# EAGLE schematic DP_current_measure_v2 (EAGLE 9.4.2)
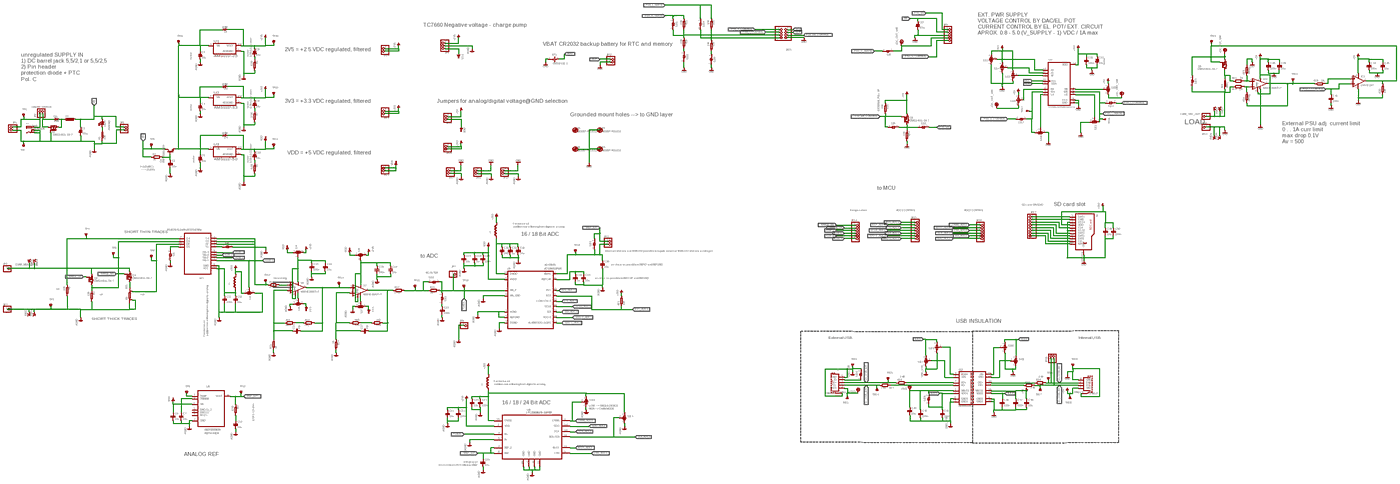
[diagram p0: schematic, sheet 1, overview]
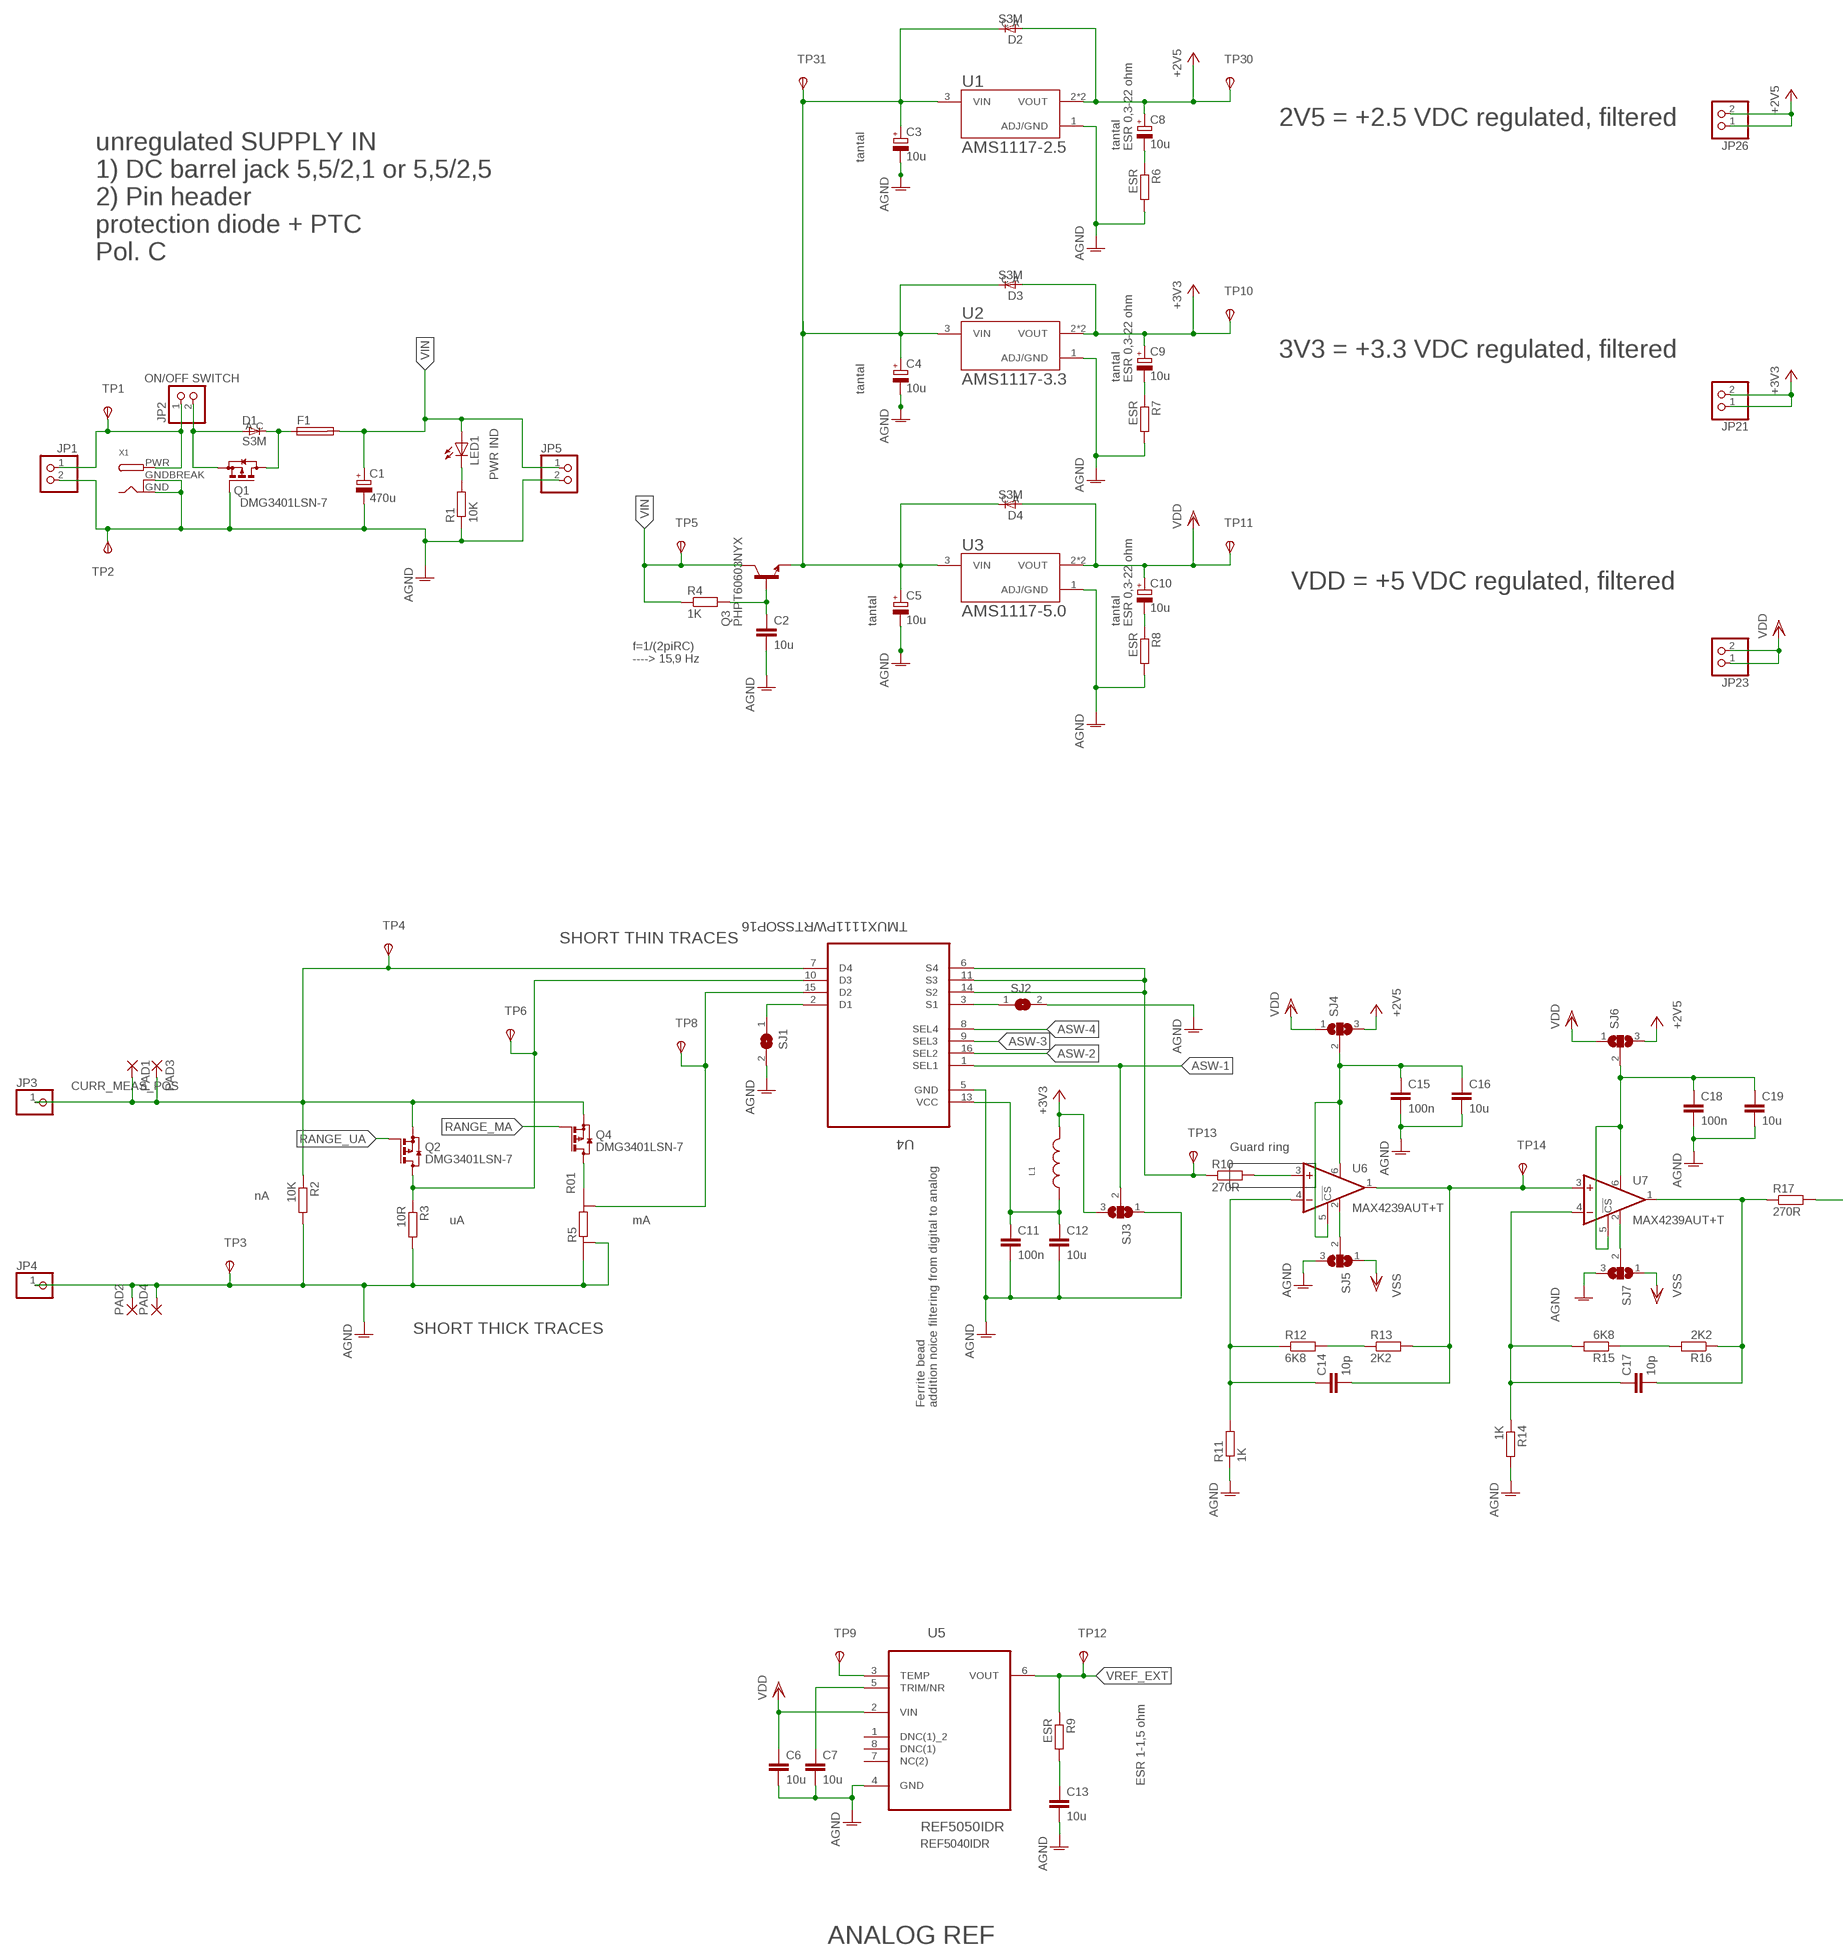
[diagram p1: schematic, sheet 1, part 1 of 4]
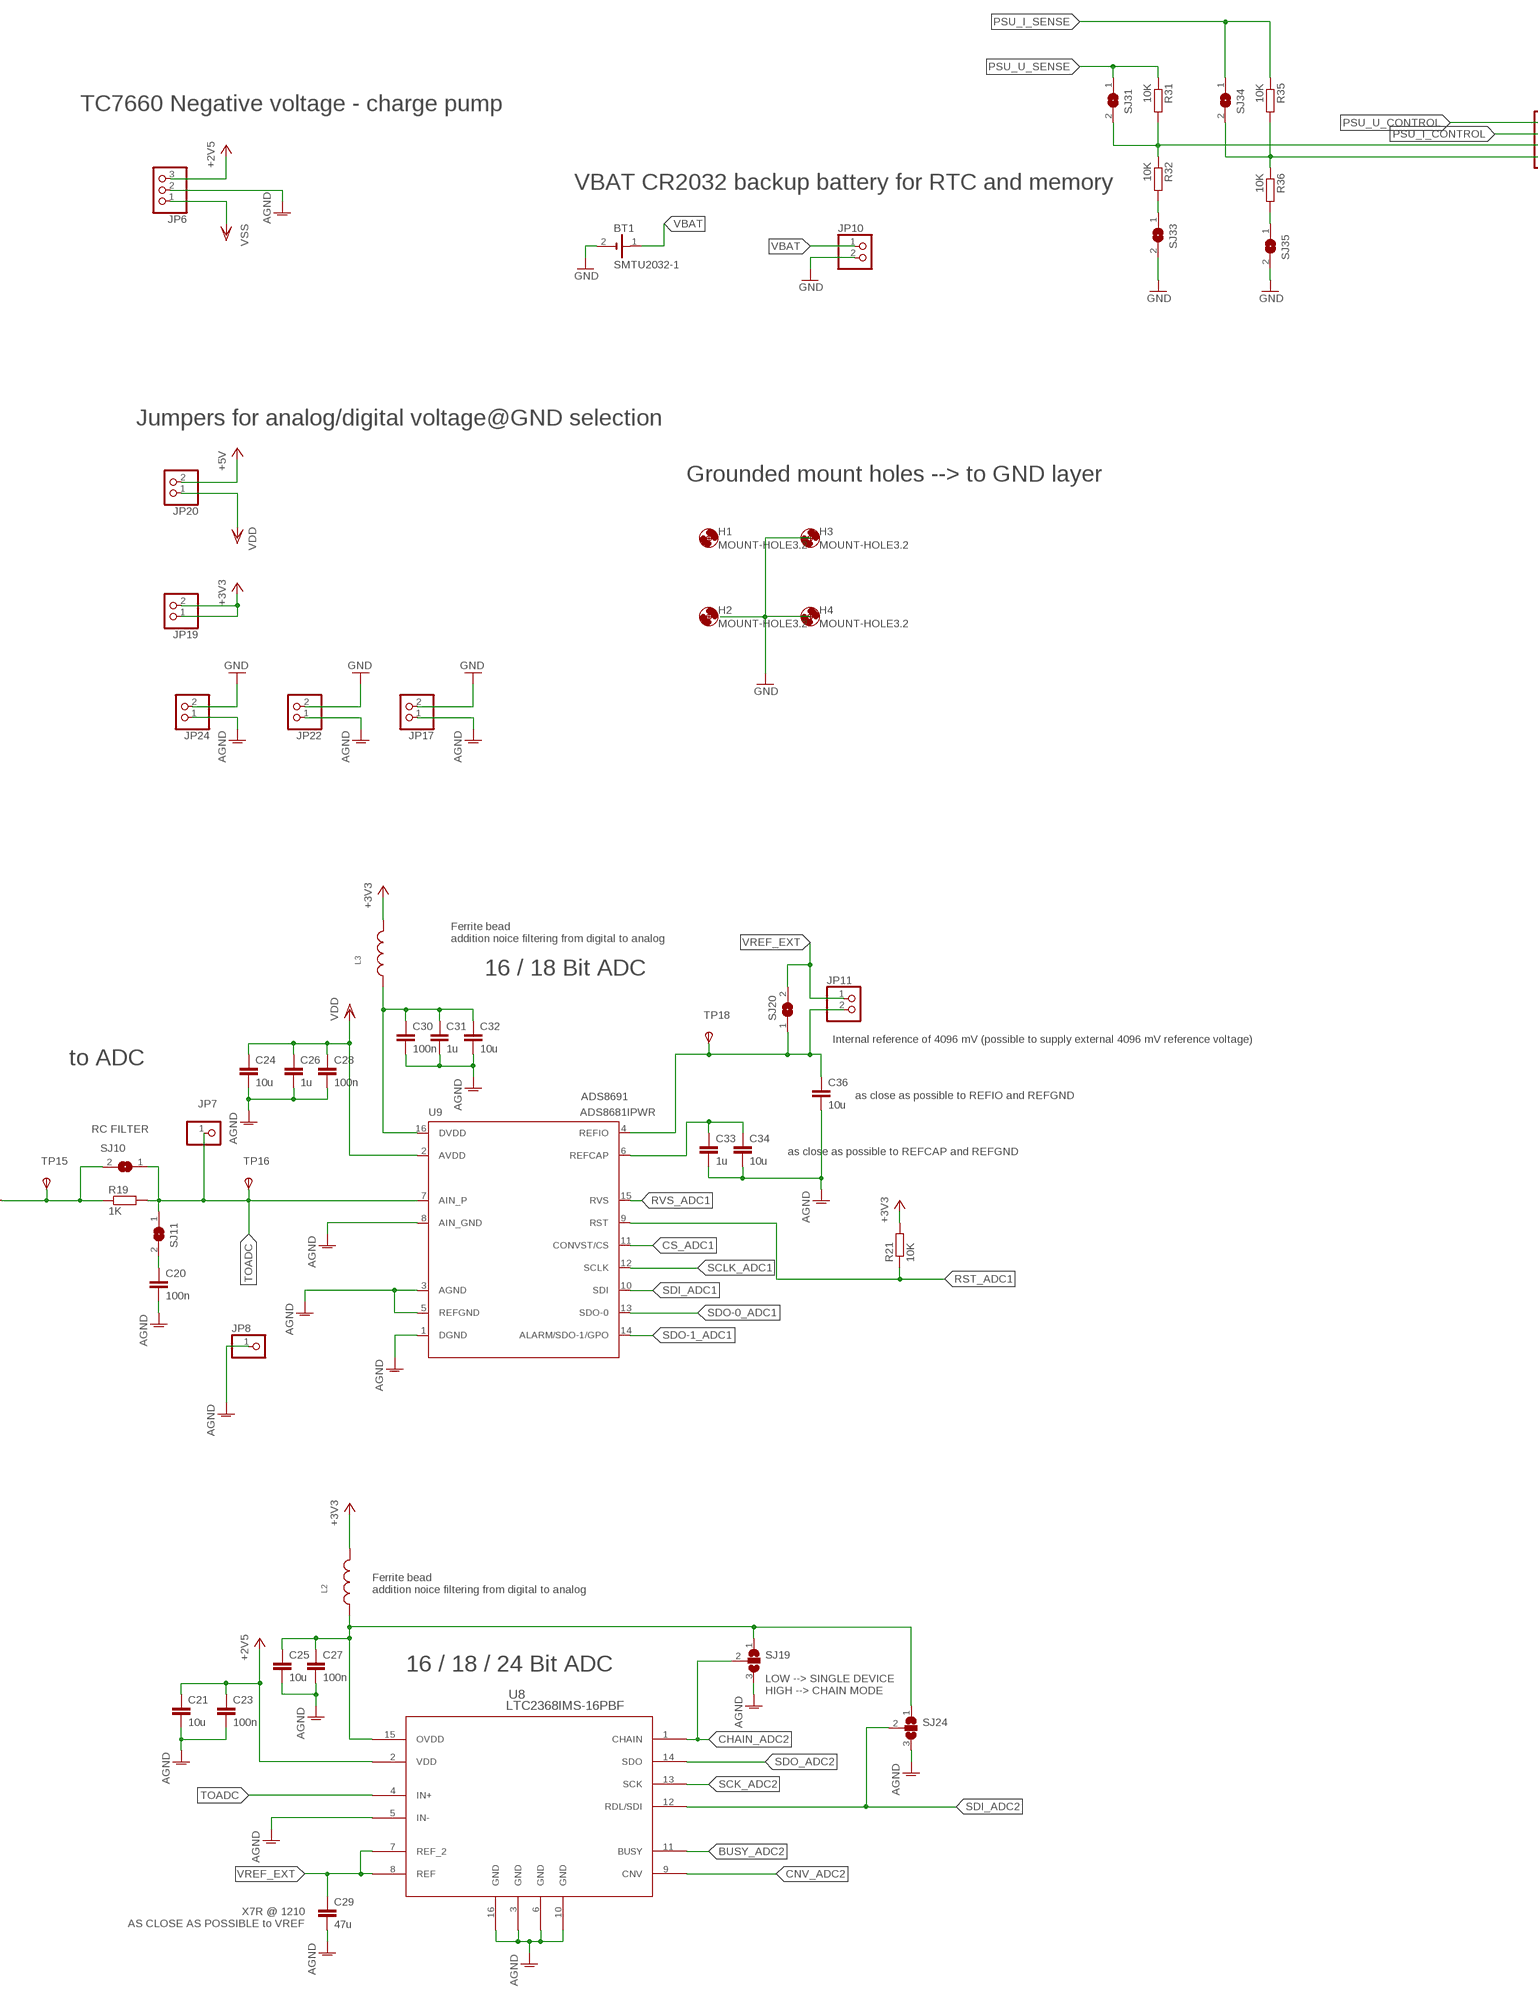
[diagram p2: schematic, sheet 1, part 2 of 4]
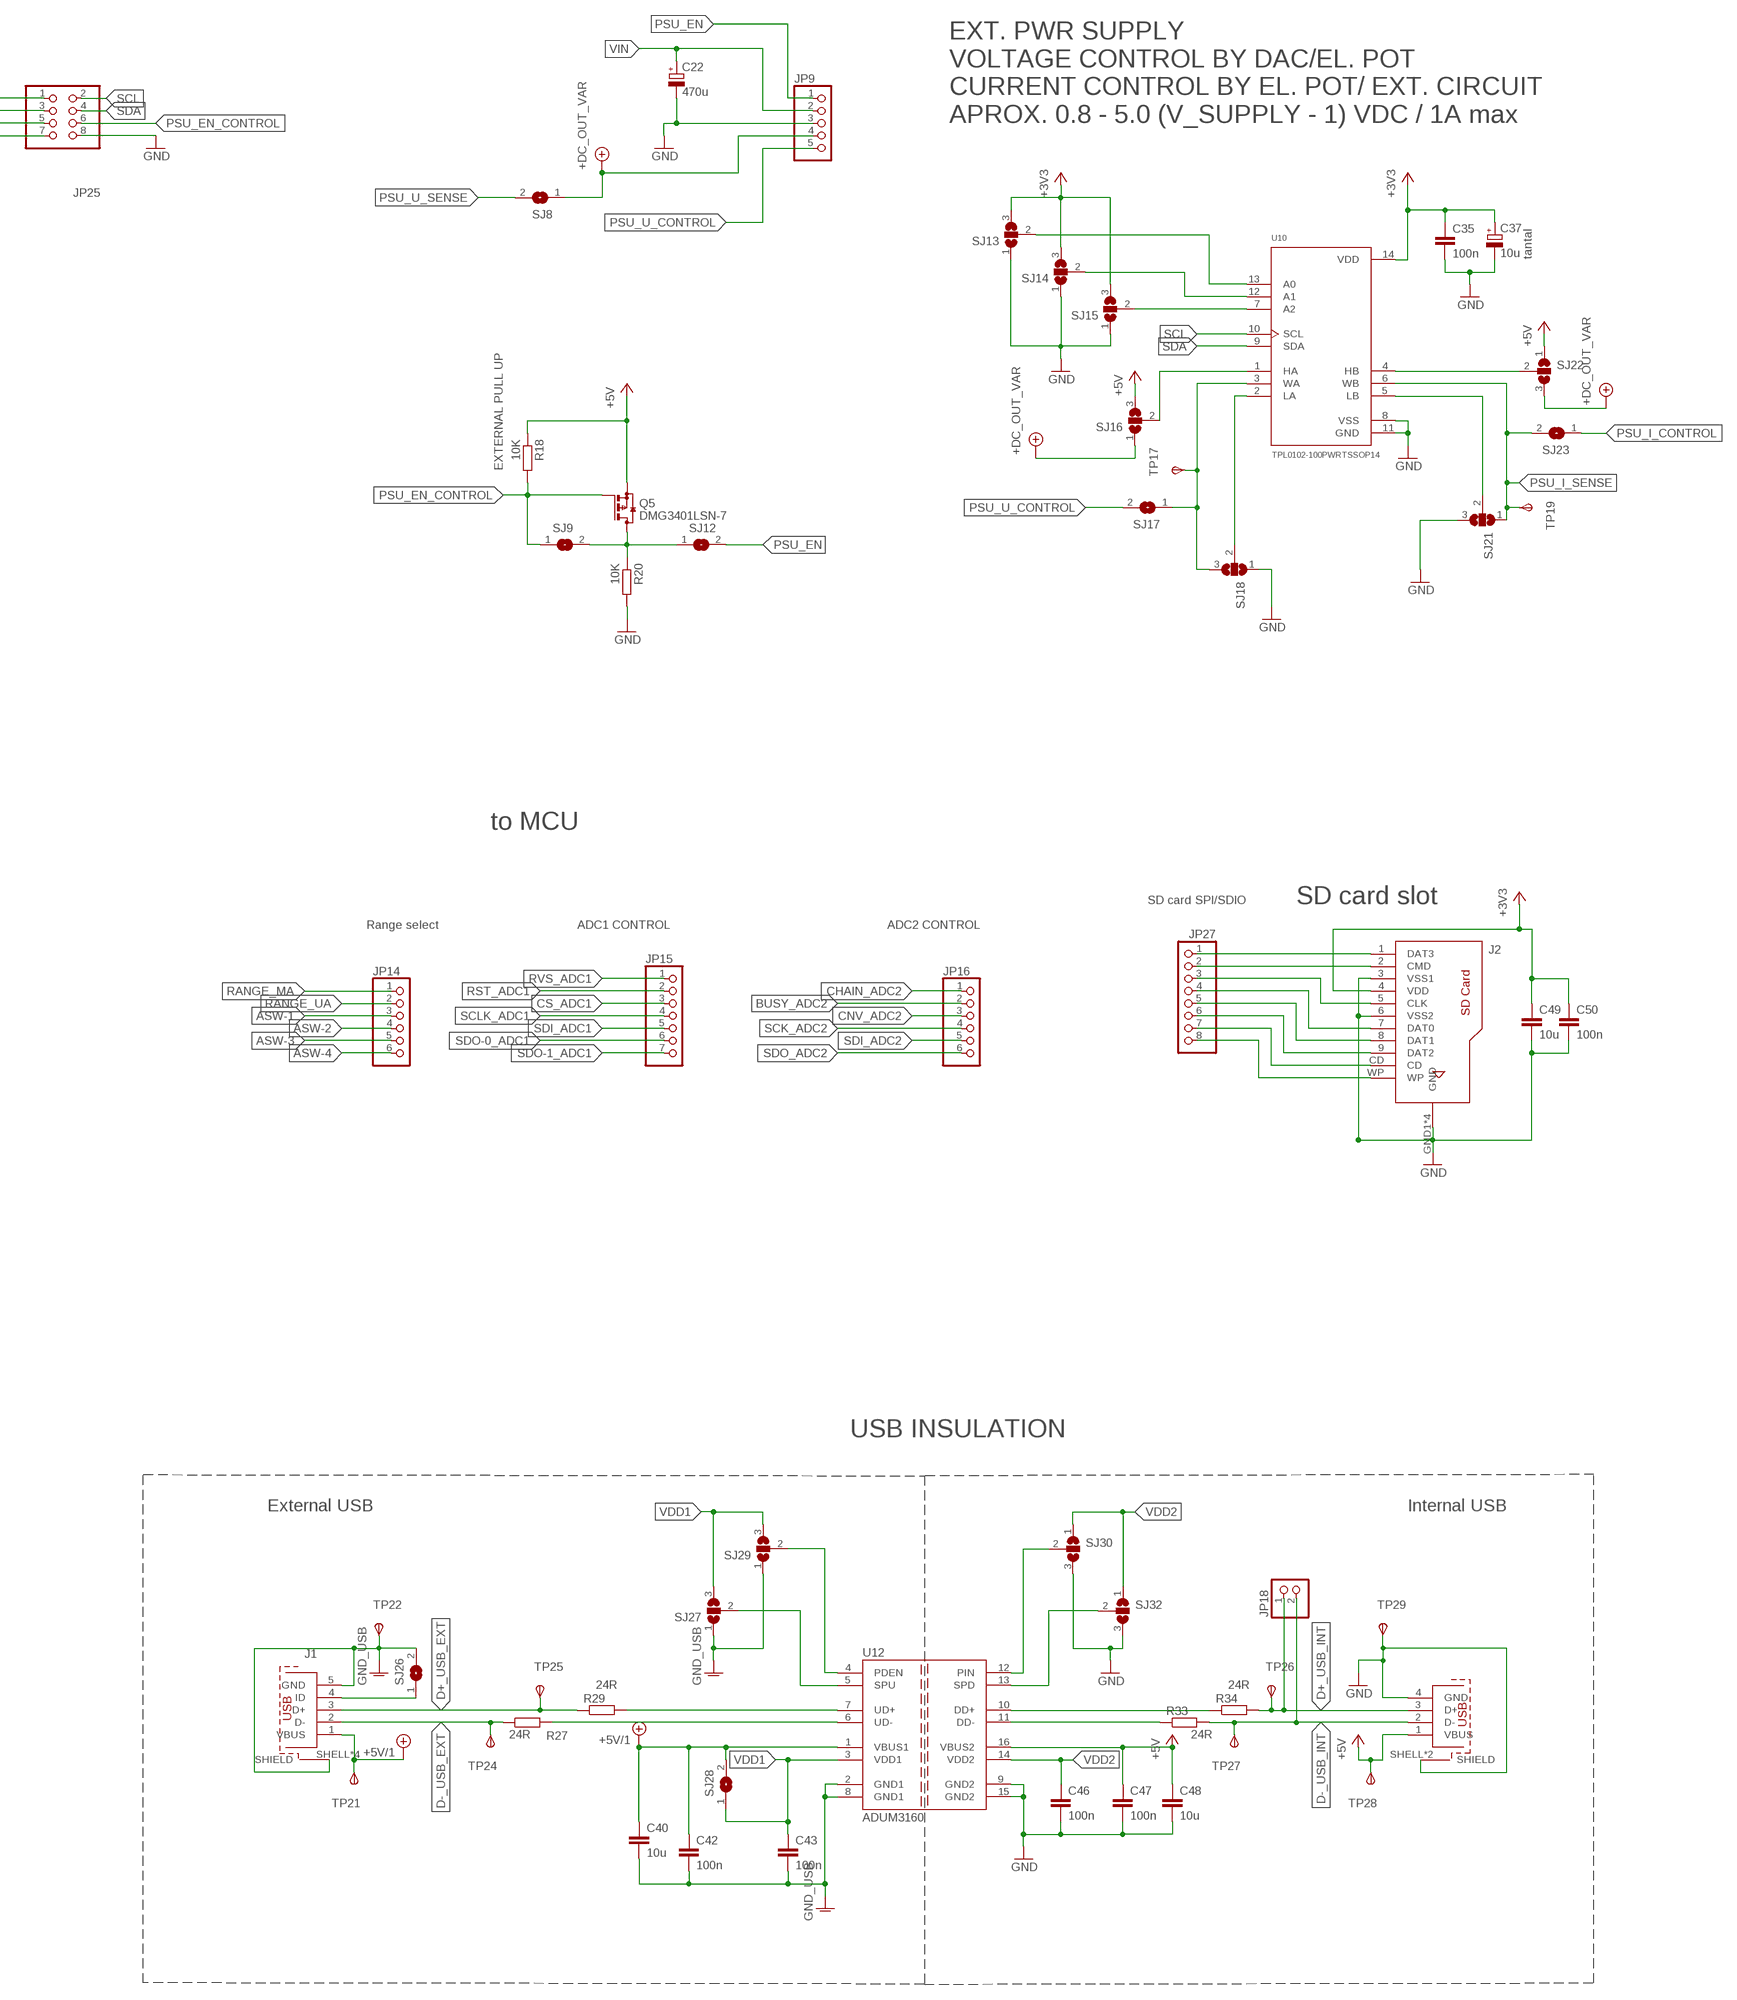
[diagram p3: schematic, sheet 1, part 3 of 4]
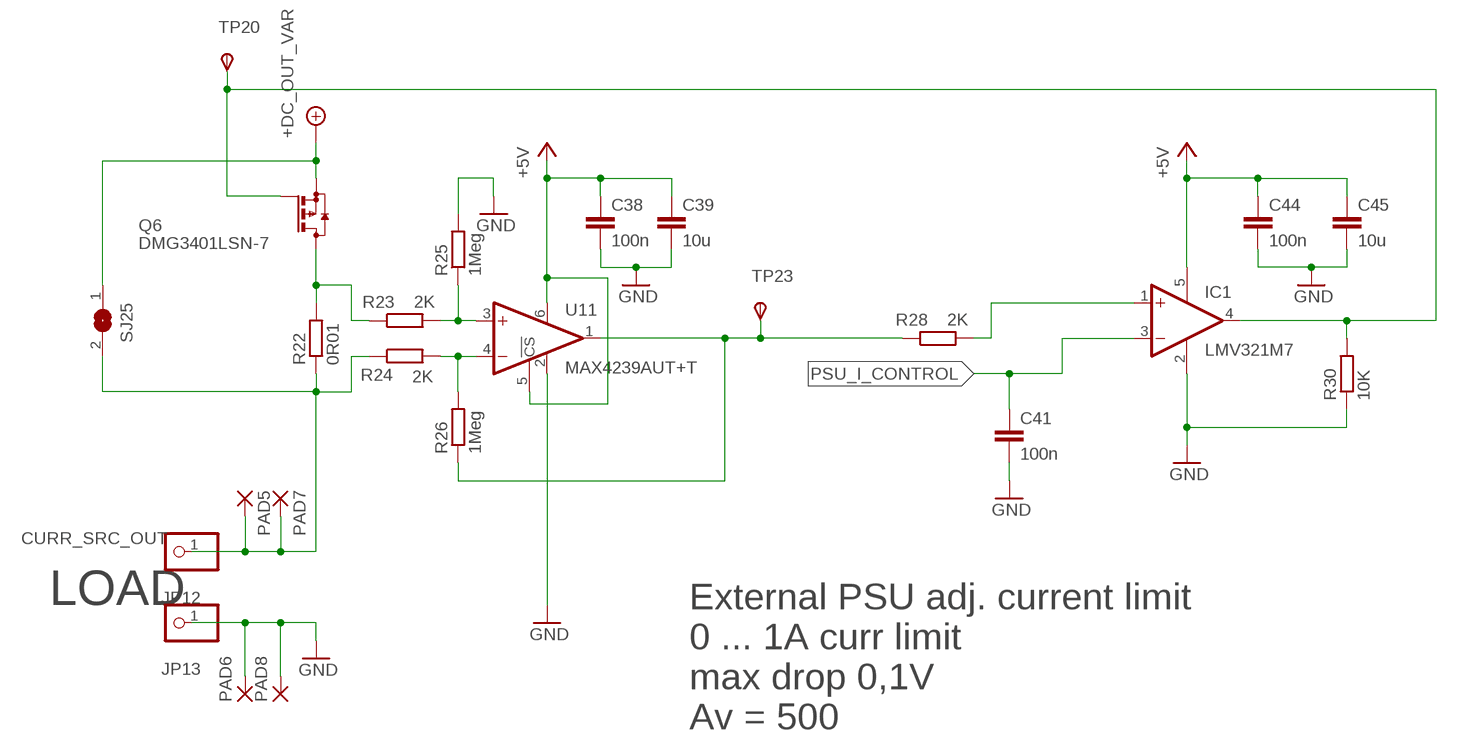
[diagram p4: schematic, sheet 1, part 4 of 4]

## Parts
BT1  SMTU2032-1  [RENATA_SMTU2032-1]
C1  470u  CPOL-EUG  [PANASONIC_G]
C2  10u  C-EUC1206  [C1206]
C3  10u  CPOL-EUSMCB  [SMC_B]
C4  10u  CPOL-EUSMCB  [SMC_B]
C5  10u  CPOL-EUSMCB  [SMC_B]
C6  10u  C-EUC1206  [C1206]
C7  10u  C-EUC1206  [C1206]
C8  10u  CPOL-EUSMCB  [SMC_B]
C9  10u  CPOL-EUSMCB  [SMC_B]
C10  10u  CPOL-EUSMCB  [SMC_B]
C11  100n  C-EUC0805  [C0805]
C12  10u  C-EUC1206  [C1206]
C13  10u  C-EUC1206  [C1206]
C14  10p  C-EUC0805  [C0805]
C15  100n  C-EUC0805  [C0805]
C16  10u  C-EUC1206  [C1206]
C17  10p  C-EUC0805  [C0805]
C18  100n  C-EUC0805  [C0805]
C19  10u  C-EUC1206  [C1206]
C20  100n  C-EUC1206  [C1206]
C21  10u  C-EUC1206  [C1206]
C22  470u  CPOL-EUG  [PANASONIC_G]
C23  100n  C-EUC0805  [C0805]
C24  10u  C-EUC1206  [C1206]
C25  10u  C-EUC1206  [C1206]
C26  1u  C-EUC0805  [C0805]
C27  100n  C-EUC0805  [C0805]
C28  100n  C-EUC0805  [C0805]
C29  47u  C-EUC1210  [C1210]
C30  100n  C-EUC0805  [C0805]
C31  1u  C-EUC0805  [C0805]
C32  10u  C-EUC1206  [C1206]
C33  1u  C-EUC0805  [C0805]
C34  10u  C-EUC1206  [C1206]
C35  100n  C-EUC0805  [C0805]
C36  10u  C-EUC1206  [C1206]
C37  10u  CPOL-EUSMCB  [SMC_B]
C38  100n  C-EUC0805  [C0805]
C39  10u  C-EUC1206  [C1206]
C40  10u  C-EUC1206  [C1206]
C41  100n  C-EUC0805  [C0805]
C42  100n  C-EUC0805  [C0805]
C43  100n  C-EUC0805  [C0805]
C44  100n  C-EUC0805  [C0805]
C45  10u  C-EUC1206  [C1206]
C46  100n  C-EUC0805  [C0805]
C47  100n  C-EUC0805  [C0805]
C48  10u  C-EUC1206  [C1206]
C49  10u  C-EUC1206  [C1206]
C50  100n  C-EUC0805  [C0805]
D1  S3M  S1M  [DO214AC]
D2  S3M  S1M  [DO214AC]
D3  S3M  S1M  [DO214AC]
D4  S3M  S1M  [DO214AC]
F1  MF-MSMF050-2  [1812]
H1  MOUNT-HOLE3.2  [3,2]
H2  MOUNT-HOLE3.2  [3,2]
H3  MOUNT-HOLE3.2  [3,2]
H4  MOUNT-HOLE3.2  [3,2]
IC1  LMV321M7  [SC70-5L]
J1  629105150521  [629105150521]
J2  693063020911  [693063020911]
J3  614004185023  [614004185023]
JP1  PINHD-1X2  [1X02]
JP2  PINHD-1X2  [1X02]
JP3  PINHD-1X1  [1X01]
JP4  PINHD-1X1  [1X01]
JP5  PINHD-1X2  [1X02]
JP6  PINHD-1X3  [1X03]
JP7  PINHD-1X1  [1X01]
JP8  PINHD-1X1  [1X01]
JP9  PSU_STEP_DOWN  [1X05]
JP10  PINHD-1X2  [1X02]
JP11  PINHD-1X2  [1X02]
JP12  PINHD-1X1  [1X01]
JP13  PINHD-1X1  [1X01]
JP14  PINHD-1X6  [1X06]
JP15  PINHD-1X7  [1X07]
JP16  PINHD-1X6  [1X06]
JP17  PINHD-1X2  [1X02]
JP18  PINHD-1X2  [1X02]
JP19  PINHD-1X2  [1X02]
JP20  PINHD-1X2  [1X02]
JP21  PINHD-1X2  [1X02]
JP22  PINHD-1X2  [1X02]
JP23  PINHD-1X2  [1X02]
JP24  PINHD-1X2  [1X02]
JP25  PINHD-2X4  [2X04]
JP26  PINHD-1X2  [1X02]
JP27  PINHD-1X8  [1X08]
L1  WE-CBF_0805_742792036_WB_HS  [WE-CBF_0805(W=3.0)]
L2  WE-CBF_0805_742792036_WB_HS  [WE-CBF_0805(W=3.0)]
L3  WE-CBF_0805_742792036_WB_HS  [WE-CBF_0805(W=3.0)]
LED1  LEDCHIPLED_0805  [CHIPLED_0805]
PAD1  WIREPADSMD2,54-5,08  [SMD2,54-5,08]
PAD2  WIREPADSMD2,54-5,08  [SMD2,54-5,08]
PAD3  WIREPADSMD2,54-5,08  [SMD2,54-5,08]
PAD4  WIREPADSMD2,54-5,08  [SMD2,54-5,08]
PAD5  WIREPADSMD2,54-5,08  [SMD2,54-5,08]
PAD6  WIREPADSMD2,54-5,08  [SMD2,54-5,08]
PAD7  WIREPADSMD2,54-5,08  [SMD2,54-5,08]
PAD8  WIREPADSMD2,54-5,08  [SMD2,54-5,08]
Q1  DMG3401LSN-7  [SOT23]
Q2  DMG3401LSN-7  [SOT23]
Q3  PHPT60603NYX  [TO127P600X120-5N]
Q4  DMG3401LSN-7  [SOT23]
Q5  DMG3401LSN-7  [SOT23]
Q6  DMG3401LSN-7  [SOT23]
R1  10K  R-EU_R0805  [R0805]
R2  10K  R-EU_R0805  [R0805]
R3  10R  R-EU_R0805  [R0805]
R4  1K  R-EU_R0805  [R0805]
R5  R01  CSM_R01  [R2512]
R6  ESR  R-EU_R0805  [R0805]
R7  ESR  R-EU_R0805  [R0805]
R8  ESR  R-EU_R0805  [R0805]
R9  ESR  R-EU_R0805  [R0805]
R10  270R  R-EU_R0805  [R0805]
R11  1K  R-EU_R0805  [R0805]
R12  6K8  R-EU_R0805  [R0805]
R13  2K2  R-EU_R0805  [R0805]
R14  1K  R-EU_R0805  [R0805]
R15  6K8  R-EU_R0805  [R0805]
R16  2K2  R-EU_R0805  [R0805]
R17  270R  R-EU_R0805  [R0805]
R18  10K  R-EU_R0805  [R0805]
R19  1K  R-EU_R0805  [R0805]
R20  10K  R-EU_R0805  [R0805]
R21  10K  R-EU_R0805  [R0805]
R22  0R01  R-EU_R0805  [R0805]
R23  2K  R-EU_R0805  [R0805]
R24  2K  R-EU_R0805  [R0805]
R25  1Meg  R-EU_R0805  [R0805]
R26  1Meg  R-EU_R0805  [R0805]
R27  24R  R-EU_R0805  [R0805]
R28  2K  R-EU_R0805  [R0805]
R29  24R  R-EU_R0805  [R0805]
R30  10K  R-EU_R0805  [R0805]
R31  10K  R-EU_R0805  [R0805]
R32  10K  R-EU_R0805  [R0805]
R33  24R  R-EU_R0805  [R0805]
R34  24R  R-EU_R0805  [R0805]
R35  10K  R-EU_R0805  [R0805]
R36  10K  R-EU_R0805  [R0805]
SJ1  SJ  [SJ]
SJ2  SJ  [SJ]
SJ3  SJ2W  [SJ_2]
SJ4  SJ2W  [SJ_2]
SJ5  SJ2W  [SJ_2]
SJ6  SJ2W  [SJ_2]
SJ7  SJ2W  [SJ_2]
SJ8  SJ  [SJ]
SJ9  SJ  [SJ]
SJ10  SJ  [SJ]
SJ11  SJ  [SJ]
SJ12  SJ  [SJ]
SJ13  SJ2W  [SJ_2]
SJ14  SJ2W  [SJ_2]
SJ15  SJ2W  [SJ_2]
SJ16  SJ2W  [SJ_2]
SJ17  SJ  [SJ]
SJ18  SJ2W  [SJ_2]
SJ19  SJ2W  [SJ_2]
SJ20  SJ  [SJ]
SJ21  SJ2W  [SJ_2]
SJ22  SJ2W  [SJ_2]
SJ23  SJ  [SJ]
SJ24  SJ2W  [SJ_2]
SJ25  SJ  [SJ]
SJ26  SJ  [SJ]
SJ27  SJ2W  [SJ_2]
SJ28  SJ  [SJ]
SJ29  SJ2W  [SJ_2]
SJ30  SJ2W  [SJ_2]
SJ31  SJ  [SJ]
SJ32  SJ2W  [SJ_2]
SJ33  SJ  [SJ]
SJ34  SJ  [SJ]
SJ35  SJ  [SJ]
TP1  TPSB1,27  [B1,27]
TP2  TPSB1,27  [B1,27]
TP3  TPSB1,27  [B1,27]
TP4  TPSB1,27  [B1,27]
TP5  TPSB1,27  [B1,27]
TP6  TPSB1,27  [B1,27]
TP8  TPSB1,27  [B1,27]
TP9  TPSB1,27  [B1,27]
TP10  TPSB1,27  [B1,27]
TP11  TPSB1,27  [B1,27]
TP12  TPSB1,27  [B1,27]
TP13  TPSB1,27  [B1,27]
TP14  TPSB1,27  [B1,27]
TP15  TPSB1,27  [B1,27]
TP16  TPSB1,27  [B1,27]
TP17  TPSB1,27  [B1,27]
TP18  TPSB1,27  [B1,27]
TP19  TPSB1,27  [B1,27]
TP20  TPSB1,27  [B1,27]
TP21  TPSB1,27  [B1,27]
TP22  TPSB1,27  [B1,27]
TP23  TPSB1,27  [B1,27]
TP24  TPSB1,27  [B1,27]
TP25  TPSB1,27  [B1,27]
TP26  TPSB1,27  [B1,27]
TP27  TPSB1,27  [B1,27]
TP28  TPSB1,27  [B1,27]
TP29  TPSB1,27  [B1,27]
TP30  TPSB1,27  [B1,27]
TP31  TPSB1,27  [B1,27]
U1  AMS1117-2.5  AMS1117-5.0  [SOT229P700X180-4N]
U2  AMS1117-3.3  AMS1117-5.0  [SOT229P700X180-4N]
U3  AMS1117-5.0  [SOT229P700X180-4N]
U4  TMUX1111PWRTSSOP16  [SOP65P640X110-16N]
U5  REF5050IDR  [SOIC127P600X175-8N]
U6  MAX4239AUT+T  [SOT23-6]
U7  MAX4239AUT+T  [SOT23-6]
U8  LTC2368IMS-16PBF  [MSOP-16_MS]
U9  ADS8681IPWR  [SOP65P640X120-16N]
U10  TPL0102-100PWRTSSOP14  [SOP65P640X120-14N]
U11  MAX4239AUT+T  [SOT23-6]
U12  ADUM3160  [SO16W]
X1  DCBARRELPTH  [DCJACK_2MM_PTH]

## Nets
+2V5: C8.+ C21.1 C23.1 D2.A JP6.3 JP26.1 JP26.2 SJ4.3 SJ6.3 TP30.TP(PP) U1.2(VOUT) U1.4(VOUT) U8.2(VDD)
+3V3: C9.+ C35.1 C37.+ C49.1 C50.1 D3.A J2.4(VDD) JP19.1 JP19.2 JP21.1 JP21.2 L1.2 L2.2 L3.2 R21.2 SJ3.3 SJ13.3 SJ14.3 SJ15.3 TP10.TP(PP) U2.2(VOUT) U2.4(VOUT) U10.14(VDD)
+5V: C38.1 C39.1 C44.1 C45.1 C47.1 C48.1 IC1.5(V+) J3.1(VBUS) JP20.2 Q5.2(S) R18.1 SJ16.3 SJ22.1 TP28.TP(PP) U11.5(!CS) U11.6(V+) U12.16(VBUS2)
+5V/1: C40.1 C42.1 J1.1(VBUS) SJ28.2 TP21.TP(PP) U12.1(VBUS1)
AGND: C1.- C2.2 C3.- C4.- C5.- C6.2 C7.2 C11.2 C12.2 C13.2 C15.2 C16.2 C18.2 C19.2 C20.2 C21.2 C23.2 C24.2 C25.2 C26.2 C27.2 C28.2 C29.2 C30.2 C31.2 C32.2 C33.2 C34.2 C36.2 JP1.2 JP4.1 JP5.2 JP6.2 JP8.1 JP17.1 JP22.1 JP24.1 PAD2.1(P) PAD4.1(P) Q1.1(G) R1.1 R2.2 R3.2 R5.E1 R5.I1 R6.2 R7.2 R8.2 R11.1 R14.2 SJ1.2 SJ2.2 SJ3.1 SJ5.3 SJ7.3 SJ19.3 SJ24.3 TP2.TP(PP) TP3.TP(PP) U1.1(ADJ/GND) U2.1(ADJ/GND) U3.1(ADJ/GND) U4.5(GND) U5.4(GND) U8.3(GND) U8.5(IN-) U8.6(GND) U8.10(GND) U8.16(GND) U9.1(DGND) U9.3(AGND) U9.5(REFGND) U9.8(AIN_GND) X1.GND X1.GNDBREAK
ASW-1: JP14.3 SJ3.2 U4.1(SEL1)
ASW-2: JP14.4 U4.16(SEL2)
ASW-3: JP14.5 U4.9(SEL3)
ASW-4: JP14.6 U4.8(SEL4)
BUSY_ADC2: JP16.2 U8.11(BUSY)
CHAIN_ADC2: JP16.1 SJ19.2 U8.1(CHAIN)
CNV_ADC2: JP16.3 U8.9(CNV)
CS_ADC1: JP15.3 U9.11(CONVST/CS)
CURR_MEAS_POS: JP3.1 PAD1.1(P) PAD3.1(P) Q2.2(S) Q4.2(S) R2.1 TP4.TP(PP) U4.7(D4)
CURR_SRC_OUT: JP12.1 PAD5.1(P) PAD7.1(P) R22.1 R24.1 SJ25.2
D+_USB_EXT: J1.3(D+) R29.1 TP25.TP(PP)
D+_USB_INT: J3.3(D+) JP18.1 R34.2 TP26.TP(PP)
D-_USB_EXT: J1.2(D-) R27.1 TP24.TP(PP)
D-_USB_INT: J3.2(D-) JP18.2 R33.2 TP27.TP(PP)
DC_OUT_VAR: JP9.4 Q6.2(S) SJ8.1 SJ16.1 SJ22.3 SJ25.1 ; supply symbol labelled +DC_OUT_VAR
GND: BT1.2(-) C22.- C35.2 C37.- C38.2 C39.2 C41.2 C44.2 C45.2 C46.2 C47.2 C48.2 C49.2 C50.2 IC1.2(V-) J2.3(VSS1) J2.6(VSS2) J2.GND1(GND) J2.GND2(GND) J2.GND3(GND) J2.GND4(GND) J3.4(GND) J3.SHELL1(SHIELD) J3.SHELL(SHIELD) JP9.3 JP10.2 JP13.1 JP17.2 JP22.2 JP24.2 JP25.8 PAD6.1(P) PAD8.1(P) R20.2 R25.2 R30.1 SJ13.1 SJ14.1 SJ15.1 SJ18.1 SJ21.3 SJ30.3 SJ32.3 SJ33.2 SJ35.2 TP29.TP(PP) U10.8(VSS) U10.11(GND) U11.2(V-) U12.9(GND2) U12.15(GND2)
GND_EXT: C40.2 C42.2 C43.2 J1.5(GND) J1.SHELL1(SHIELD) J1.SHELL2(SHIELD) J1.SHELL3(SHIELD) J1.SHELL(SHIELD) SJ26.2 SJ27.1 SJ29.1 TP22.TP(PP) U12.2(GND1) U12.8(GND1) ; supply symbol labelled GND_USB
MA_RANGE_SENSE: R5.E2 TP8.TP(PP) U4.15(D2)
N$1: C17.2 R16.1 R17.1 U7.1(OUT)
N$2: R15.1 R16.2
N$3: C17.1 R14.1 R15.2 U7.4(-IN)
N$4: R12.2 R13.1
N$5: C14.2 R13.2 TP14.TP(PP) U6.1(OUT) U7.3(+IN)
N$6: R10.1 TP13.TP(PP) U4.6(S4) U4.11(S3) U4.14(S2)
N$7: C14.1 R11.2 R12.1 U6.4(-IN)
N$8: C11.1 C12.1 L1.1 U4.13(VCC)
N$9: SJ16.2 U10.1(HA)
N$10: SJ17.1 SJ18.3 TP17.TP(PP) U10.3(WA)
N$11: Q6.3(D) R22.2 R23.1
N$12: SJ15.2 U10.7(A2)
N$13: SJ7.2 U7.2(V-)
N$15: R10.2 U6.3(+IN)
N$16: C9.- R7.1
N$17: Q4.3(D) R5.I2
N$18: SJ5.2 U6.2(V-)
N$19: R17.2 R19.1 SJ10.2 TP15.TP(PP)
N$20: C10.- R8.1
N$21: SJ13.2 U10.13(A0)
N$22: C8.- R6.1
N$23: C2.1 Q3.4(B) R4.2
N$24: C7.1 U5.5(TRIM/NR)
N$25: C20.1 SJ11.2
N$26: SJ14.2 U10.12(A1)
N$27: JP25.7 R35.2 R36.1 SJ34.2
N$28: JP25.5 R31.2 R32.1 SJ31.2
N$29: R36.2 SJ35.1
N$30: R32.2 SJ33.1
N$31: R26.1 R28.1 TP23.TP(PP) U11.1(OUT)
N$32: SJ22.2 U10.4(HB)
N$33: J1.4(ID) SJ26.1
N$34: R23.2 R25.1 U11.3(+IN)
N$35: SJ18.2 U10.2(LA)
N$36: IC1.4(OUT) Q6.1(G) R30.2 TP20.TP(PP)
N$37: R24.2 R26.2 U11.4(-IN)
N$38: C18.1 C19.1 SJ6.2 U7.5(!CS) U7.6(V+)
N$39: D1.C F1.1 Q1.3(D)
N$40: C33.1 C34.1 U9.6(REFCAP)
N$41: C36.1 JP11.2 SJ20.1 TP18.TP(PP) U9.4(REFIO)
N$42: D1.A JP2.2 Q1.2(S)
N$43: R34.1 U12.10(DD+)
N$44: LED1.C R1.2
N$45: SJ21.2 U10.5(LB)
N$46: C15.1 C16.1 SJ4.2 U6.5(!CS) U6.6(V+)
N$47: TP9.TP(PP) U5.3(TEMP)
N$48: J2.1(DAT3) JP27.1
N$49: J2.2(CMD) JP27.2
N$50: J2.5(CLK) JP27.3
N$51: J2.7(DAT0) JP27.4
N$52: SJ30.2 U12.12(PIN)
N$53: SJ32.2 U12.13(SPD)
N$54: SJ27.2 U12.5(SPU)
N$55: SJ29.2 U12.4(PDEN)
N$56: SJ2.1 U4.3(S1)
N$57: SJ1.1 U4.2(D1)
N$58: J2.8(DAT1) JP27.5
N$59: C13.1 R9.2
N$60: J2.9(DAT2) JP27.6
N$61: J2.CD JP27.7
N$62: J2.WP JP27.8
N$63: JP1.1 JP2.1 TP1.TP(PP) X1.PWR
N$65: C30.1 C31.1 C32.1 L3.1 U9.16(DVDD)
N$66: C25.1 C27.1 L2.1 SJ19.1 SJ24.1 U8.15(OVDD)
OPAMP_LEADS: IC1.1(+IN) R28.2
PSU_EN: JP9.1 SJ12.2
PSU_EN_CONTROL: JP25.6 Q5.1(G) R18.2 SJ9.1
PSU_EN_LEAD: Q5.3(D) R20.1 SJ9.2 SJ12.1
PSU_I_CONTROL: C41.1 IC1.3(-IN) JP25.3 SJ23.1
PSU_I_SENSE: R35.1 SJ21.1 SJ23.2 SJ34.1 TP19.TP(PP) U10.6(WB)
PSU_U_CONTROL: JP9.5 JP25.1 SJ17.2
PSU_U_SENSE: R31.1 SJ8.2 SJ31.1
RANGE_MA: JP14.1 Q4.1(G)
RANGE_UA: JP14.2 Q2.1(G)
RST_ADC1: JP15.2 R21.1 U9.9(RST)
RVS_ADC1: JP15.1 U9.15(RVS)
SCK_ADC2: JP16.4 U8.13(SCK)
SCL: JP25.2 U10.10(SCL)
SCLK_ADC1: JP15.4 U9.12(SCLK)
SDA: JP25.4 U10.9(SDA)
SDI_ADC1: JP15.5 U9.10(SDI)
SDI_ADC2: JP16.5 SJ24.2 U8.12(RDL/SDI)
SDO-0_ADC1: JP15.6 U9.13(SDO-0)
SDO-1_ADC1: JP15.7 U9.14(ALARM/SDO-1/GPO)
SDO_ADC2: JP16.6 U8.14(SDO)
TOADC: JP7.1 R19.2 SJ10.1 SJ11.1 TP16.TP(PP) U8.4(IN+) U9.7(AIN_P)
UA_RANGE_SENSE: Q2.3(D) R3.1 TP6.TP(PP) U4.10(D3)
USB_EXT_N [diff_pair]: R27.2 U12.6(UD-)
USB_EXT_P [diff_pair]: R29.2 U12.7(UD+)
USB_INT_N [diff_pair]: R33.1 U12.11(DD-)
V_FILTR_UNREG: C3.+ C4.+ C5.+ D2.C D3.C D4.C Q3.1(E) Q3.2(E) Q3.3(E) TP31.TP(PP) U1.3(VIN) U2.3(VIN) U3.3(VIN)
VBAT: BT1.1(+) JP10.1
VDD: C6.1 C10.+ C24.1 C26.1 C28.1 D4.A JP20.1 JP23.1 JP23.2 SJ4.1 SJ6.1 TP11.TP(PP) U3.2(VOUT) U3.4(VOUT) U5.2(VIN) U9.2(AVDD)
VDD1: C43.1 SJ27.3 SJ28.1 SJ29.3 U12.3(VDD1)
VDD2: C46.1 SJ30.1 SJ32.1 U12.14(VDD2)
VIN: C1.+ C22.+ F1.2 JP5.1 JP9.2 LED1.A Q3.5(C) R4.1 TP5.TP(PP)
VREF_EXT: C29.1 JP11.1 R9.1 SJ20.2 TP12.TP(PP) U5.6(VOUT) U8.7(REF_2) U8.8(REF)
VSS: JP6.1 SJ5.1 SJ7.1
Unconnected: U5.1(DNC(1)_2) U5.7(NC(2)) U5.8(DNC(1))

## Notes on the sheet
- TC7660 Negative voltage - charge pump
- EXT. PWR SUPPLY
  VOLTAGE CONTROL BY DAC/EL. POT
  CURRENT CONTROL BY EL. POT/ EXT. CIRCUIT
  APROX. 0.8 - 5.0 (V_SUPPLY - 1) VDC / 1A max
- VBAT CR2032 backup battery for RTC and memory
- 2V5 = +2.5 VDC regulated, filtered
- tantal
  ESR 0,3-22 ohm
- tantal
- tantal
- unregulated SUPPLY IN
  1) DC barrel jack 5,5/2,1 or 5,5/2,5
  2) Pin header
  protection diode + PTC
  Pol. C
- 3V3 = +3.3 VDC regulated, filtered | Jumpers for analog/digital voltage@GND selection
- ON/OFF SWITCH
- tantal
  ESR 0,3-22 ohm
- tantal | EXTERNAL PULL UP
- Grounded mount holes --> to GND layer
- LOAD
- PWR IND
- External PSU adj. current limit
  0 ... 1A curr limit 
  max drop 0,1V
  Av = 500
- VDD = +5 VDC regulated, filtered
- tantal
- tantal
  ESR 0,3-22 ohm
- f=1/(2piRC) 
  ----> 15,9 Hz
- to MCU
- SD card SPI/SDIO | SD card slot
- Range select | ADC1 CONTROL | ADC2 CONTROL
- Ferrite bead
  addition noice filtering from digital to analog
- SHORT THIN TRACES
- 16 / 18 Bit ADC
- Internal reference of 4096 mV (possible to supply external 4096 mV reference voltage)
- to ADC
- ADS8691 | as close as possible to REFIO and REFGND
- RC FILTER
- Guard ring | as close as possible to REFCAP and REFGND
- nA
- uA | mA
- SHORT THICK TRACES
- USB INSULATION
- Ferrite bead
  addition noice filtering from digital to analog
- External USB | Internal USB
- Ferrite bead
  addition noice filtering from digital to analog
- 16 / 18 / 24 Bit ADC
- LOW --> SINGLE DEVICE
  HIGH --> CHAIN MODE
- ESR 1-1,5 ohm
- REF5040IDR
- ANALOG REF
- X7R @ 1210
  AS CLOSE AS POSSIBLE to VREF

## Library data of the parts
BT1 = SMTU2032-1:SMTU2032-1: Battery Renata Battery Holder; AVAILABILITY: Unavailable; DESCRIPTION: Battery Renata Battery Holder; MF: Renata; MP: SMTU2032-1; PACKAGE: None; PRICE: None
C1 C3-C5 C8-C10 C22 C37 = rcl:CPOL-EU: POLARIZED CAPACITOR, European symbol; SPICEPREFIX: C
C2 C6 C7 C11-C21 C23-C36 C38-C50 = rcl:C-EU: CAPACITOR, European symbol; SPICEPREFIX: C
D1-D4 = DIODE:S1M
F1 = Thermistor_Inductors:MF-MSMF050-2: PTC RESET FUSE 15V 500MA 1812 Manufacturer's datasheet <https://www.bourns.com/docs/Product-Datasheets/mfmsmf.pdf>; CREATED_BY: PCBLayout.com; DIGIKEY_PART_NUMBER: MF-MSMF050-2TR-ND; MANUFACTURER: Bourns Inc.; MPN: MF-MSMF050-2; PACKAGE: 1812
H1-H4 = holes:MOUNT-HOLE: MOUNTING HOLE with drill center marker
IC1 = linear:LMV321?*: General Purpose, Low Voltage, Rail-to-Rail Output Operational Amplifiers Source: http://www.national.com/mpf/LM/LMV321.html http://www.national.com/dt/lmv_qual.pdf
J1 = Wurth_Elektronik_Electromechanic_Input-Output_Connectors_rev19a:629105150521: WR-COM_USB_Micro Type B_Horizontal_SMT ; Micro Type B Horizontal SMT - 3A current at Pin1 & Pin 5 - with Pegs and THT shielding Pins - T&R Packaging Code : Con_I-O_COM_USB_2.0_B_629105150521_629105150521 <http://katalog.we-online.de/media/images/eican/Con_I-O_COM_USB_2.0_B_629105150521_pf2.jpg> Details see: http://katalog.we-online.de/em/datasheet/629105150521.pdf Created 12/08/2014, Dan Xu 2014 (C) Wurth Elektronik
J2 = Wurth_Elektronik_Electromechanic_Input-Output_Connectors_rev19a:693063020911: WR-CRD SD CARD CONNECTOR PUSH & PULL SHORT TYPE WITH CARD DETECTION 9PINS=>Code : Con_I-O_COM_CRD_SD_Normal_693063020911 <http://katalog.we-online.de/media/images/eican/Con_I-O_COM_CRD_SD_Normal_693063020911_pf2.jpg> Details see: http://katalog.we-online.de/en/em/CRD_SD_PUSH_AND_PULL_CRD_DETETCION_SHORT_TYPE_9_PINS/693063020911 Created 2014-07-09, Karrer Zheng 2014 (C) Würth Elektronik
J3 = Wurth_Elektronik_Electromechanic_Input-Output_Connectors_rev19a:614004185023: USB TYPE A VERTICAL THT - SHORT TYPE =>ConUSB2 61400185023 Characteristics INSULATOR:PBT FLAMMABILITY RATING: UL94-V0 COLOR: WHITE CONTACT MATERIAL: COPPER ALLOY CONTACT PLATING: GOLD OVER Ni COVER MATERIAL: BRASS COVER PLATING: Ni QUALITY CLASS:15000 MATING CYCLES OPERATING TEMPERATURE:-55°C UP TO +85°C COMPLIANCE: LEAD FREE AND ROHS ELECTRICAL CURRENT RATING: 1.5A MAX WORKING VOLTAGE: 30 VAC MAX WITHSTANDING VOLTAGE: 500 VAC/MIN INSULATION RESISTANCE: > 1000 MΩ CONTACT RESISTANCE: 30 mΩ MAX <http://katalog.we-online.de/media/images/v2/Family_WR-COM_614004185023_4C.jpg> Details see: http://katalog.we-online.de/en/em/COM_THT_TYPE_A_VERTICAL_SHORT_TYPE/614004185023 2015 (C) Wurth Elektronik
JP1 JP2 JP5 JP10 JP11 JP17-JP24 JP26 = pinhead:PINHD-1X2: PIN HEADER
JP3 JP4 JP7 JP8 JP12 JP13 = pinhead:PINHD-1X1: PIN HEADER
JP6 = pinhead:PINHD-1X3: PIN HEADER
JP9 = SM_PSU:PSU_STEP_DOWN: PIN HEADER
JP14 JP16 = pinhead:PINHD-1X6: PIN HEADER
JP15 = pinhead:PINHD-1X7: PIN HEADER
JP25 = pinhead:PINHD-2X4: PIN HEADER
JP27 = pinhead:PINHD-1X8: PIN HEADER
L1-L3 = Wurth_Elektronik_Passive_rev19e:WE-CBF_0805: WE-CBF SMD EMI Suppression Ferrite Bead Characteristics Reliable Ni-Sn electrodes High rated current up to 6 A Operating temperature: –55 ºC to +125 ºC Applications Perfect as data lined filter and for uncoupling of distribution voltage Variant abbreviation WB means WIDE BAND HS means HIGH SPEED HC means HIGH CURRENT <http://katalog.we-online.de/media/images/v2/Family_WE-CBF.jpg> Details see: http://katalog.we-online.de/en/pbs/WE-CBF Updated on 2014-06-19 2014 (C) Wurth Elektronik; WE-NUMBER: 742792036/470Ω(Z@100MHz)
LED1 = adafruit:LED: LED OSRAM: - CHIPLED LG R971, LG N971, LY N971, LG Q971, LY Q971, LO R971, LY R971 LH N974, LH R974 LS Q976, LO Q976, LY Q976 LO Q996 - Hyper CHIPLED LW Q18S LB Q993, LB Q99A, LB R99A - SideLED LS A670, LO A670, LY A670, LG A670, LP A670 LB A673, LV A673, LT A673, LW A673 LH A674 LY A675 LS A676, LA A676, LO A676, LY A676, LW A676 LS A679, LY A679, LG A679 - Hyper Micro SIDELED® LS Y876, LA Y876, LO Y876, LY Y876 LT Y87S - SmartLED LW L88C, LW L88S LB L89C, LB L89S, LG L890 LS L89K, LO L89K, LY L89K LS L896, LA L896, LO L896, LY L896 - TOPLED LS T670, LO T670, LY T670, LG T670, LP T670 LSG T670, LSP T670, LSY T670, LOP T670, LYG T670 LG T671, LOG T671, LSG T671 LB T673, LV T673, LT T673, LW T673 LH T674 LS T676, LA T676, LO T676, LY T676, LB T676, LH T676, LSB T676, LW T676 LB T67C, LV T67C, LT T67C, LS T67K, LO T67K, LY T67K, LW E67C LS E67B, LA E67B, LO E67B, LY E67B, LB E67C, LV E67C, LT E67C LW T67C LS T679, LY T679, LG T679 LS T770, LO T770, LY T770, LG T770, LP T770 LB T773, LV T773, LT T773, LW T773 LH T774 LS E675, LA E675, LY E675, LS T675 LS T776, LA T776, LO T776, LY T776, LB T776 LHGB T686 LT T68C, LB T68C - Hyper Mini TOPLED® LB M676 - Mini TOPLED Santana® LG M470 LS M47K, LO M47K, LY M47K Source: http://www.osram.convergy.de/
PAD1-PAD8 = wirepad:WIREPAD: Wire PAD connect wire on PCB
Q1 Q2 Q4-Q6 = DMG_transistor:DMG3401LSN-7
Q3 = BJT:PHPT60603NYX
R1-R4 R6-R36 = rcl:R-EU_: RESISTOR, European symbol; SPICEPREFIX: R
R5 = RLC_special:CSM_R01
SJ1 SJ2 SJ8-SJ12 SJ17 SJ20 SJ23 SJ25 SJ26 SJ28 SJ31 SJ33-SJ35 = jumper:SJ: SMD solder JUMPER
SJ3-SJ7 SJ13-SJ16 SJ18 SJ19 SJ21 SJ22 SJ24 SJ27 SJ29 SJ30 SJ32 = jumper:SJ2W: SMD solder JUMPER
TP1-TP6 TP8-TP31 = testpad:TPS: TEST PIN
U1-U3 = AMS1117-5.0:AMS1117-5.0: Sot223/Pkg 1-Amp 5-Volt Low Drop Out Voltage Regulatator; AVAILABILITY: Unavailable; DESCRIPTION: Sot223/Pkg 1-Amp 5-Volt Low Drop Out Voltage Regulatator; MF: Advanced Monolithic Systems; MP: AMS1117-5.0; PACKAGE: None; PRICE: None
U4 = TMUX1111:TMUX1111PWR
U5 = REF5050IDR:REF5050IDR: Low-Noise, Very Low Drift, Precision VOLTAGE REFERENCE; AVAILABILITY: Unavailable; DESCRIPTION: Low Noise, Very Low Drift, Precision VOLTAGE REFERENCE 8-SOIC -40 to 125; MF: Texas Instruments; MP: REF5050IDR; PACKAGE: SOIC-8 Texas Instruments; PRICE: None
U6 U7 U11 = MAX4239:MAX4239AUT+T
U8 = LTC2368IMS-16PBF:LTC2368IMS-16PBF; AVAILABILITY: Unavailable; DESCRIPTION: Data acquisition IC - AD converter _ADC_ Linear Technology LTC2368IMS-16#PBF External MSOP 16; MF: Linear Technology; MP: LTC2368IMS-16#PBF; PACKAGE: MSOP-16 Linear Technology; PRICE: None
U9 = ADC:ADS8681IPWR
U10 = TPL0102-100RUCR:TPL0102-100PWR
U12 = ADUM3160:ADUM3160: Analog Devices ADuM3160 (pin compatible with ADuM4160) USB port isolator; AVAILABILITY: Unavailable; DESCRIPTION: ADI 2.5kVFull/Low Speed USB Digital Isolator; MF: Analog Devices; MP: ADUM3160; PACKAGE: SOIC-16 Analog Devices; PRICE: None
X1 = DC_jack:DCBARREL: 2.0mm DC Barrel Jack DCJACK_2MM_PTH - Through Hole Jack (4UConnector: 05537)

## Net classes
1 diff_pair: width 0.254 mm